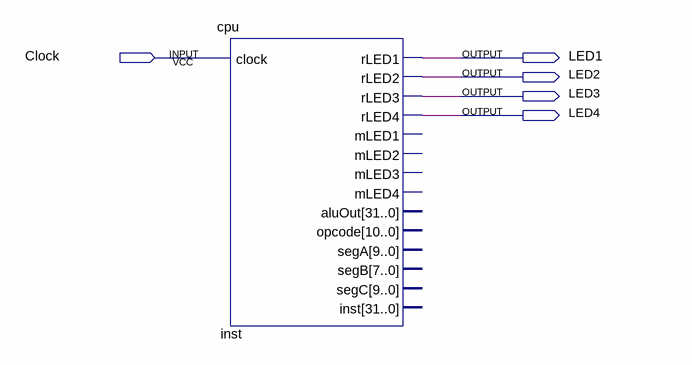
[diagram p0: schematic sheet]
// Quartus schematic ARM_Processor.bdf as structural Verilog: 1 symbols, 5 pins
module ARM_Processor (
  input  Clock,
  output LED1,
  output LED2,
  output LED3,
  output LED4
);

  cpu inst (
    .rLED1(LED1), .rLED2(LED2), .rLED3(LED3), .rLED4(LED4));  // open: clock, mLED1, mLED2, mLED3, mLED4, aluOut, opcode, segA, segB, segC, inst
endmodule
